# EAGLE design adapter (EAGLE 9.2.0)
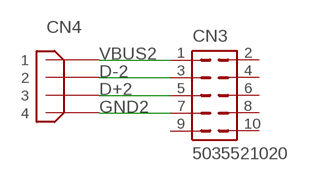
[diagram p0: schematic, sheet 1]

## Parts
CN3  5035521020  [5035521020]
CN4  USB  [USB]

## Nets
D+2: CN3.5 CN4.D+
D-2 [Signal]: CN3.3 CN4.D-
GND2: CN3.7 CN4.GND
VBUS2: CN3.1 CN4.VBUS
Unconnected: CN3.2 CN3.4 CN3.6 CN3.8 CN3.9 CN3.10

## Library data of the parts
CN3 = connector:5035521020
CN4 = connector:USB

## Net classes
0 PWR: width 0.254 mm
1 Signal: width 0.152 mm

## Board
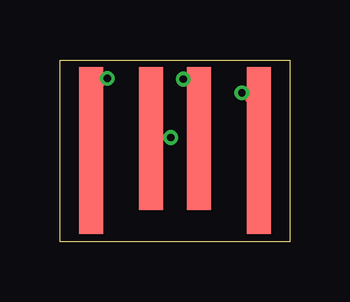
[diagram p1: board, top side]
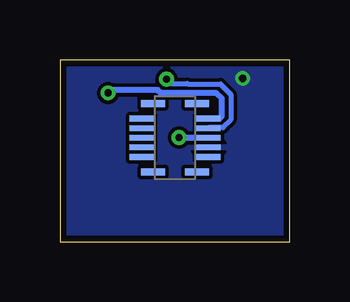
[diagram p2: board, bottom side, seen from below]

Size 9.6 x 7.6 mm. Coordinates in mm from the lower left corner, seen from the top.
Outline: 0,7.6 9.6,7.6 9.6,0 0,0 0,7.6
Copper layers (1*16): Top 0.035mm / dielectric 1.5mm / Bottom 0.035mm
Design rules "Elecrow_2-layer_eagle_rule": minimum track width 6mil, minimum drill 12mil, track to track 6mil, track to pad 6mil, pad to pad 6mil, via to via 6mil, smd to smd 0mil, copper to edge 10mil, drill to drill 10mil, minimum pad ring 10mil, minimum via ring 6mil, stop-mask expansion 2mil, vias tented up to drill 100mil, thermal gap 10mil

### Footprints (pad centres in the part's own frame; a part is rotated, then mirrored left to right if it is on the bottom)
5035521020 = smd 0.24 x 1: 1 0.8,-1.4; 2 0.8,1.4; 3 0.4,-1.4; 4 0.4,1.4; 5 0,-1.4; 6 0,1.4; 7 -0.4,-1.4; 8 -0.4,1.4; 9 -0.8,-1.4; 10 -0.8,1.4 | smd 0.3 x 1: NC1 1.43,0.92; NC2 -1.43,0.92; NC3 1.43,-0.92; NC4 -1.43,-0.92
USB = smd 1 x 5.94: D+ 2.5,0.5; D- 4.5,0.5 | smd 1 x 6.94: GND 0,0; VBUS 7,0

### Placement (x,y rotation side)
CN3  4.8,4.35 90 bottom
CN4  1.3,3.82 0 top

### Tracks (layer width: path | path; a pad name or v marks a point on that pad's centre or on a via)
D+2  (via drill 0.3)
  Top 0.254: v4.63,4.36 3.84,4.36 CN4.D+
  Bottom 0.254: v4.63,4.36 v4.62,4.35 CN3.5
D-2  (via drill 0.3)
  Top 0.254: v5.15,6.8 5.8,6.15 CN4.D-
  Bottom 0.203: v5.15,6.8 4.97,6.62 4.29,6.62 4.27,6.59 2.9,6.59 2.47,6.16 2.47,5.09 2.79,4.77 3.38,4.77 CN3.3
GND2  (via drill 0.3)
  Top 0.254: v1.98,6.83 1.3,6.15 CN4.GND
  pour Bottom: -0.79,8.89 10.64,8.89 10.64,-1.27 -0.79,-1.27
VBUS2  (via drill 0.3)
  Top 0.254: v7.59,6.22 8.3,5.51 CN4.VBUS
  Bottom 0.254: v7.59,6.22 7.47,6.35 5.53,6.35 5.39,6.21 3.06,6.21 2.85,6 2.85,5.25 2.95,5.15 CN3.1